# Altium project PCB_Project.PrjPcb
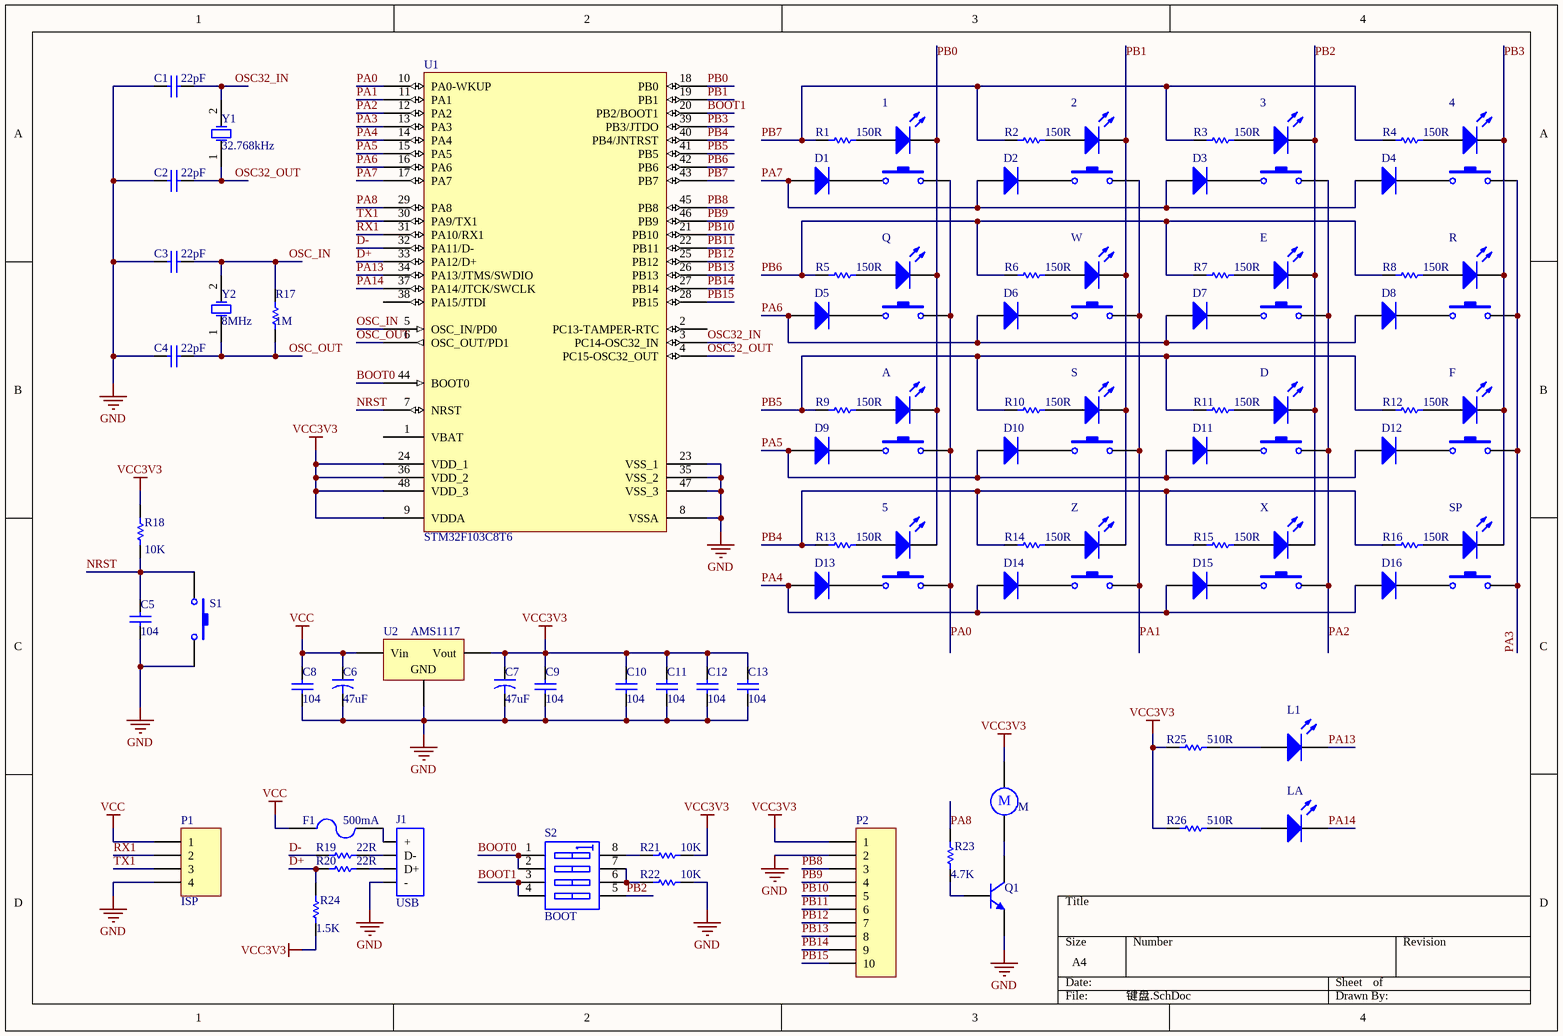
[diagram p0: 键盘.SchDoc]
1 sheet, 85 parts. Net scope: global (net labels, ports and power ports of the same name join across sheets).
Board file: 键盘.PcbDoc

## Sheet 键盘.SchDoc
size A4

### Parts
1  MX5  [MX5F]  (value not drawn)
2  MX5  [MX5F]  (value not drawn)
3  MX5  [MX5F]  (value not drawn)
4  MX5  [MX5F]  (value not drawn)
5  MX5  [MX5F]  (value not drawn)
A  MX5  [MX5F]  (value not drawn)
C1  value 22pF  [0805]  (hidden comment: Cap)
C2  value 22pF  [0805]  (hidden comment: Cap)
C3  value 22pF  [0805]  (hidden comment: Cap)
C4  value 22pF  [0805]  (hidden comment: Cap)
C5  value 104  [0805]  (hidden comment: Cap)
C6  value 47uF  [B_3528]  (hidden comment: Cap2)
C7  value 47uF  [B_3528]  (hidden comment: Cap2)
C8  value 104  [0805]  (hidden comment: Cap)
C9  value 104  [0805]  (hidden comment: Cap)
C10  value 104  [0805]  (hidden comment: Cap)
C11  value 104  [0805]  (hidden comment: Cap)
C12  value 104  [0805]  (hidden comment: Cap)
C13  value 104  [0805]  (hidden comment: Cap)
D  MX5  [MX5F]  (value not drawn)
D1  Diode  [贴片二极管]  (value not drawn)
D2  Diode  [贴片二极管]  (value not drawn)
D3  Diode  [贴片二极管]  (value not drawn)
D4  Diode  [贴片二极管]  (value not drawn)
D5  Diode  [贴片二极管]  (value not drawn)
D6  Diode  [贴片二极管]  (value not drawn)
D7  Diode  [贴片二极管]  (value not drawn)
D8  Diode  [贴片二极管]  (value not drawn)
D9  Diode  [贴片二极管]  (value not drawn)
D10  Diode  [贴片二极管]  (value not drawn)
D11  Diode  [贴片二极管]  (value not drawn)
D12  Diode  [贴片二极管]  (value not drawn)
D13  Diode  [贴片二极管]  (value not drawn)
D14  Diode  [贴片二极管]  (value not drawn)
D15  Diode  [贴片二极管]  (value not drawn)
D16  Diode  [贴片二极管]  (value not drawn)
E  MX5  [MX5F]  (value not drawn)
F  MX5  [MX5F]  (value not drawn)
F1  500mA  [1812]
J1  USB  [MiniUSB]
L1  LED  [0805]  (value not drawn)
LA  LED  [0805]  (value not drawn)
M  Motor  [Motor]  (value not drawn)
P1  ISP  [PIN4]
P2  PIN10  [PIN10]  (value not drawn)
Q  MX5  [MX5F]  (value not drawn)
Q1  NPN  [SOT-23_N]  (value not drawn)
R  MX5  [MX5F]  (value not drawn)
R1  value 150R  [0805]  (hidden comment: Res)
R2  value 150R  [0805]  (hidden comment: Res)
R3  value 150R  [0805]  (hidden comment: Res)
R4  value 150R  [0805]  (hidden comment: Res)
R5  value 150R  [0805]  (hidden comment: Res)
R6  value 150R  [0805]  (hidden comment: Res)
R7  value 150R  [0805]  (hidden comment: Res)
R8  value 150R  [0805]  (hidden comment: Res)
R9  value 150R  [0805]  (hidden comment: Res)
R10  value 150R  [0805]  (hidden comment: Res)
R11  value 150R  [0805]  (hidden comment: Res)
R12  value 150R  [0805]  (hidden comment: Res)
R13  value 150R  [0805]  (hidden comment: Res)
R14  value 150R  [0805]  (hidden comment: Res)
R15  value 150R  [0805]  (hidden comment: Res)
R16  value 150R  [0805]  (hidden comment: Res)
R17  value 1M  [0805]  (hidden comment: Res)
R18  value 10K  [0805]  (hidden comment: Res)
R19  value 22R  [0805]  (hidden comment: Res)
R20  value 22R  [0805]  (hidden comment: Res)
R21  value 10K  [0805]  (hidden comment: Res)
R22  value 10K  [0805]  (hidden comment: Res)
R23  value 4.7K  [0805]  (hidden comment: Res)
R24  value 1.5K  [0805]  (hidden comment: Res)
R25  value 510R  [0805]  (hidden comment: Res)
R26  value 510R  [0805]  (hidden comment: Res)
S  MX5  [MX5F]  (value not drawn)
S1  SW-PB  [SW]  (value not drawn)
S2  BOOT  [SW-DIP-4]
SP  MX5  [MX5F - 2]  (value not drawn)
U1  STM32F103C8T6  [LQFP48_N]
U2  AMS1117  [SOT223_N]
W  MX5  [MX5F]  (value not drawn)
X  MX5  [MX5F]  (value not drawn)
Y1  32.768kHz  [RAD0.1]
Y2  8MHz  [XTAL]
Z  MX5  [MX5F]  (value not drawn)

### Nets
GND: C1.1 C2.1 C3.1 C4.1 C5.1 C6.2 C7.2 C8.1 C9.1 C10.1 C11.1 C12.1 C13.1 J1.5(-) P1.4 P2.2 Q1.2(E) R22.1 S1.2 U1.8(VSSA) U1.23(VSS_1) U1.35(VSS_2) U1.47(VSS_3) U2.1(GND)
VCC: C6.1 C8.2 F1.1 P1.1 U2.3(Vin)
VCC3V3: C7.1 C9.2 C10.2 C11.2 C12.2 C13.2 M.1 P2.1 R18.2 R21.1 R24.1 R25.1 R26.1 U1.9(VDDA) U1.24(VDD_1) U1.36(VDD_2) U1.48(VDD_3) U2.2(Vout)
BOOT0: S2.1(A1) S2.2(A2) U1.44(BOOT0)
BOOT1: S2.3(A3) S2.4(A4) U1.20(PB2/BOOT1)
D+: R20.1 R24.2 U1.33(PA12/D+)
D-: R19.1 U1.32(PA11/D-)
NRST: C5.2 R18.1 S1.1 U1.7(NRST)
OSC32_IN: C1.2 U1.3(PC14-OSC32_IN) Y1.2(OSC2)
OSC32_OUT: C2.2 U1.4(PC15-OSC32_OUT) Y1.1(OSC1)
OSC_IN: C3.2 R17.2 U1.5(OSC_IN/PD0) Y2.2(OSC2)
OSC_OUT: C4.2 R17.1 U1.6(OSC_OUT/PD1) Y2.1(OSC1)
PA0: 1.2 5.2 A.2 Q.2 U1.10(PA0-WKUP)
PA1: 2.2 S.2 U1.11(PA1) W.2 Z.2
PA2: 3.2 D.2 E.2 U1.12(PA2) X.2
PA3: 4.2 F.2 R.2 SP.2 U1.13(PA3)
PA4: D13.1(A) D14.1(A) D15.1(A) D16.1(A) U1.14(PA4)
PA5: D9.1(A) D10.1(A) D11.1(A) D12.1(A) U1.15(PA5)
PA6: D5.1(A) D6.1(A) D7.1(A) D8.1(A) U1.16(PA6)
PA7: D1.1(A) D2.1(A) D3.1(A) D4.1(A) U1.17(PA7)
PA8: R23.2 U1.29(PA8)
PA13: L1.2(K) U1.34(PA13/JTMS/SWDIO)
PA14: LA.2(K) U1.37(PA14/JTCK/SWCLK)
PB0: 1.K 5.K A.K Q.K U1.18(PB0)
PB1: 2.K S.K U1.19(PB1) W.K Z.K
PB2: 3.K D.K E.K S2.5(B4) X.K
PB3: 4.K F.K R.K SP.K U1.39(PB3/JTDO)
PB4: R13.1 R14.1 R15.1 R16.1 U1.40(PB4/JNTRST)
PB5: R9.1 R10.1 R11.1 R12.1 U1.41(PB5)
PB6: R5.1 R6.1 R7.1 R8.1 U1.42(PB6)
PB7: R1.1 R2.1 R3.1 R4.1 U1.43(PB7)
PB8: P2.3 U1.45(PB8)
PB9: P2.4 U1.46(PB9)
PB10: P2.5 U1.21(PB10)
PB11: P2.6 U1.22(PB11)
PB12: P2.7 U1.25(PB12)
PB13: P2.8 U1.26(PB13)
PB14: P2.9 U1.27(PB14)
PB15: P2.10 U1.28(PB15)
RX1: P1.2 U1.31(PA10/RX1)
TX1: P1.3 U1.30(PA9/TX1)
Net1_1: 1.1 D1.2(K)
Net1_A: 1.A R1.2
Net2_1: 2.1 D2.2(K)
Net2_A: 2.A R2.2
Net3_1: 3.1 D3.2(K)
Net3_A: 3.A R3.2
Net4_1: 4.1 D4.2(K)
Net4_A: 4.A R4.2
Net5_1: 5.1 D13.2(K)
Net5_A: 5.A R13.2
NetA_1: A.1 D9.2(K)
NetA_A: A.A R9.2
NetD5_2: D5.2(K) Q.1
NetD6_2: D6.2(K) W.1
NetD7_2: D7.2(K) E.1
NetD8_2: D8.2(K) R.1
NetD10_2: D10.2(K) S.1
NetD12_2: D12.2(K) F.1
NetD14_2: D14.2(K) Z.1
NetD15_2: D15.2(K) X.1
NetD16_2: D16.2(K) SP.1
NetD_1: D.1 D11.2(K)
NetD_A: D.A R11.2
NetE_A: E.A R7.2
NetF1_2: F1.2 J1.1(+)
NetF_A: F.A R12.2
NetJ1_2: J1.2(D-) R19.2
NetJ1_3: J1.3(D+) R20.2
NetL1_1: L1.1(A) R25.2
NetLA_1: LA.1(A) R26.2
NetM_2: M.2 Q1.3(C)
NetQ1_1: Q1.1(B) R23.1
NetQ_A: Q.A R5.2
NetR6_2: R6.2 W.A
NetR10_2: R10.2 S.A
NetR14_2: R14.2 Z.A
NetR15_2: R15.2 X.A
NetR16_2: R16.2 SP.A
NetR21_2: R21.2 S2.8(B1)
NetR22_2: R22.2 S2.6(B3) S2.7(B2)
NetR_A: R.A R8.2

Not connected (* = marked no-connect by the designer): U1 1(VBAT) 2(PC13-TAMPER-RTC) 38(PA15/JTDI)

### Library data of the parts
C1-C5 C8-C13 = Cap: Capacitor; Published: 8-Jun-2000; LatestRevisionDate: 17-Jul-2002; LatestRevisionNote: Re-released for DXP Platform.; PackageReference: RAD-0.3; Publisher: Altium Limited; PackageDescription: Radial Cap, Thru-Hole; 2 Leads; 0.3 in Pin Spacing
C6 C7 = Cap2: Capacitor; Published: 23-Sep-2002; PackageReference: CAPR5-4X5; Publisher: Altium Limited; PackageDescription: Capacitor; 2 Leads
D1-D16 = Diode: Default Diode; Published: 8-Jun-2000; LatestRevisionDate: 17-Jul-2002; LatestRevisionNote: Re-released for DXP Platform.; PackageVersion: Sep-1996; PackageReference: SMC; Publisher: Altium Limited; PackageDescription: DO-214-AB/SMC; 2 C-Bend Leads; Body 7.9 x 5.9 mm, inc. leads (LxW); Code_JEDEC: DO-214-AB
F1 = Fuse: Published: 8-Jun-2000; LatestRevisionDate: 17-Jul-2002; LatestRevisionNote: Re-released for DXP Platform.; PackageReference: PIN-W2/E2.8; Publisher: Altium Limited; PackageDescription: Thru-Hole; 2 Leads
L1 LA = LED: Typical INFRARED GaAs LED; Published: 8-Jun-2000; LatestRevisionDate: 08-Jul-2005; LatestRevisionNote: Mech Layer 1 removed.; PackageReference: LED-0; Publisher: Altium Limited; PackageDescription: LED; 2 Leads
M = Motor: Motor, General Kind; Published: 24-Mar-1999; LatestRevisionDate: 17-Jul-2002; LatestRevisionNote: Re-released for DXP Platform.; PackageReference: RB5-10.5; Publisher: Altium Limited; PackageDescription: Capacitor (Radial); 2 Leads
P1 = PIN4: Header, 4-Pin; LatestRevisionDate: 17-Jul-2002; LatestRevisionNote: Re-released for DXP Platform.; Publisher: Altium Limited
P2 = PIN10: Header, 10-Pin; LatestRevisionDate: 17-Jul-2002; LatestRevisionNote: Re-released for DXP Platform.; Publisher: Altium Limited
Q1 = NPN: NPN Bipolar Transistor; Published: 8-Jun-2000; LatestRevisionDate: 17-Jul-2002; LatestRevisionNote: Re-released for DXP Platform.; PackageReference: TO-226-AA; Publisher: Altium Limited; PackageDescription: TO, Flat Index; 3 In-Line, Axial Leads; Body Dia. 4.8mm; Leads 0.55 x 0.51 mm (max); Code_JEDEC: TO-226-AA
R1-R26 = Res: Resistor; Published: 8-Jun-2000; LatestRevisionDate: 17-Jul-2002; LatestRevisionNote: Re-released for DXP Platform.; PackageReference: AXIAL-0.3; Publisher: Altium Limited; PackageDescription: Axial Device, Thru-Hole; 2 Leads; 0.3 in Pin Spacing
S1 = SW-PB: Switch; Published: 24-Mar-1999; LatestRevisionDate: 17-Jul-2002; LatestRevisionNote: Re-released for DXP Platform.; PackageReference: SPST-2; Publisher: Altium Limited; PackageDescription: Switch; 2 Leads
S2 = SW DIP-4: DIP Switch, 4 Position, SPST; Published: 24-Mar-1999; LatestRevisionDate: 29-May-2009; LatestRevisionNote: IPC-7351 Footprint Added.; PackageVersion: Dec-2002; PackageReference: SO8; Publisher: Altium Limited; PackageDescription: 8-Pin Small Outline Integrated Circuit 1.27 mm Pitch; Code_JEDEC: MS-012-AA; Code_IPC: SOIC127P600-8
U1 = STM32F103C8T6: STM32 ARM-based 32-bit MCU with 64 Kbytes Flash, 48-pin LQFP, Industrial Temperature; Published: 30-May-2008; DatasheetVersion: rev6, Mar-2008; PackageVersion: Mar-2008; PackageReference: LQFP48; Publisher: Altium Limited; PackageDescription: 48-Pin Low-Profile Quad Flat Pack, 7 x 7 mm Body, 0.5 mm Pitch (LQFP48); ComponentLink1Description: Manufacturer Link; ComponentLink1URL: www.st.com/stm32; ComponentLink2Description: Datasheet; ComponentLink2URL: http://www.st.com/stonline/products/literature/ds/13587.pdf
Y1 Y2 = XTAL: Crystal Oscillator; Published: 8-Jun-2000; LatestRevisionDate: 17-Jul-2002; LatestRevisionNote: Re-released for DXP Platform.; PackageReference: R38; Publisher: Altium Limited; PackageDescription: Crystal, Thru-Hole; 2 Leads; Body 3.1 x 8.2 mm (Dia.xH)
U2 = AMS1117: Published: 24-Mar-1999; LatestRevisionDate: 29-May-2009; LatestRevisionNote: IPC-7351 Footprint Added.; PackageReference: D2PAK; Publisher: Altium Limited; PackageDescription: 3-Pin Transistor Outline Package 2.54 mm Pitch, 15.1 mm Lead Span